# EAGLE design Dimmer_up_smd (EAGLE 5.04)
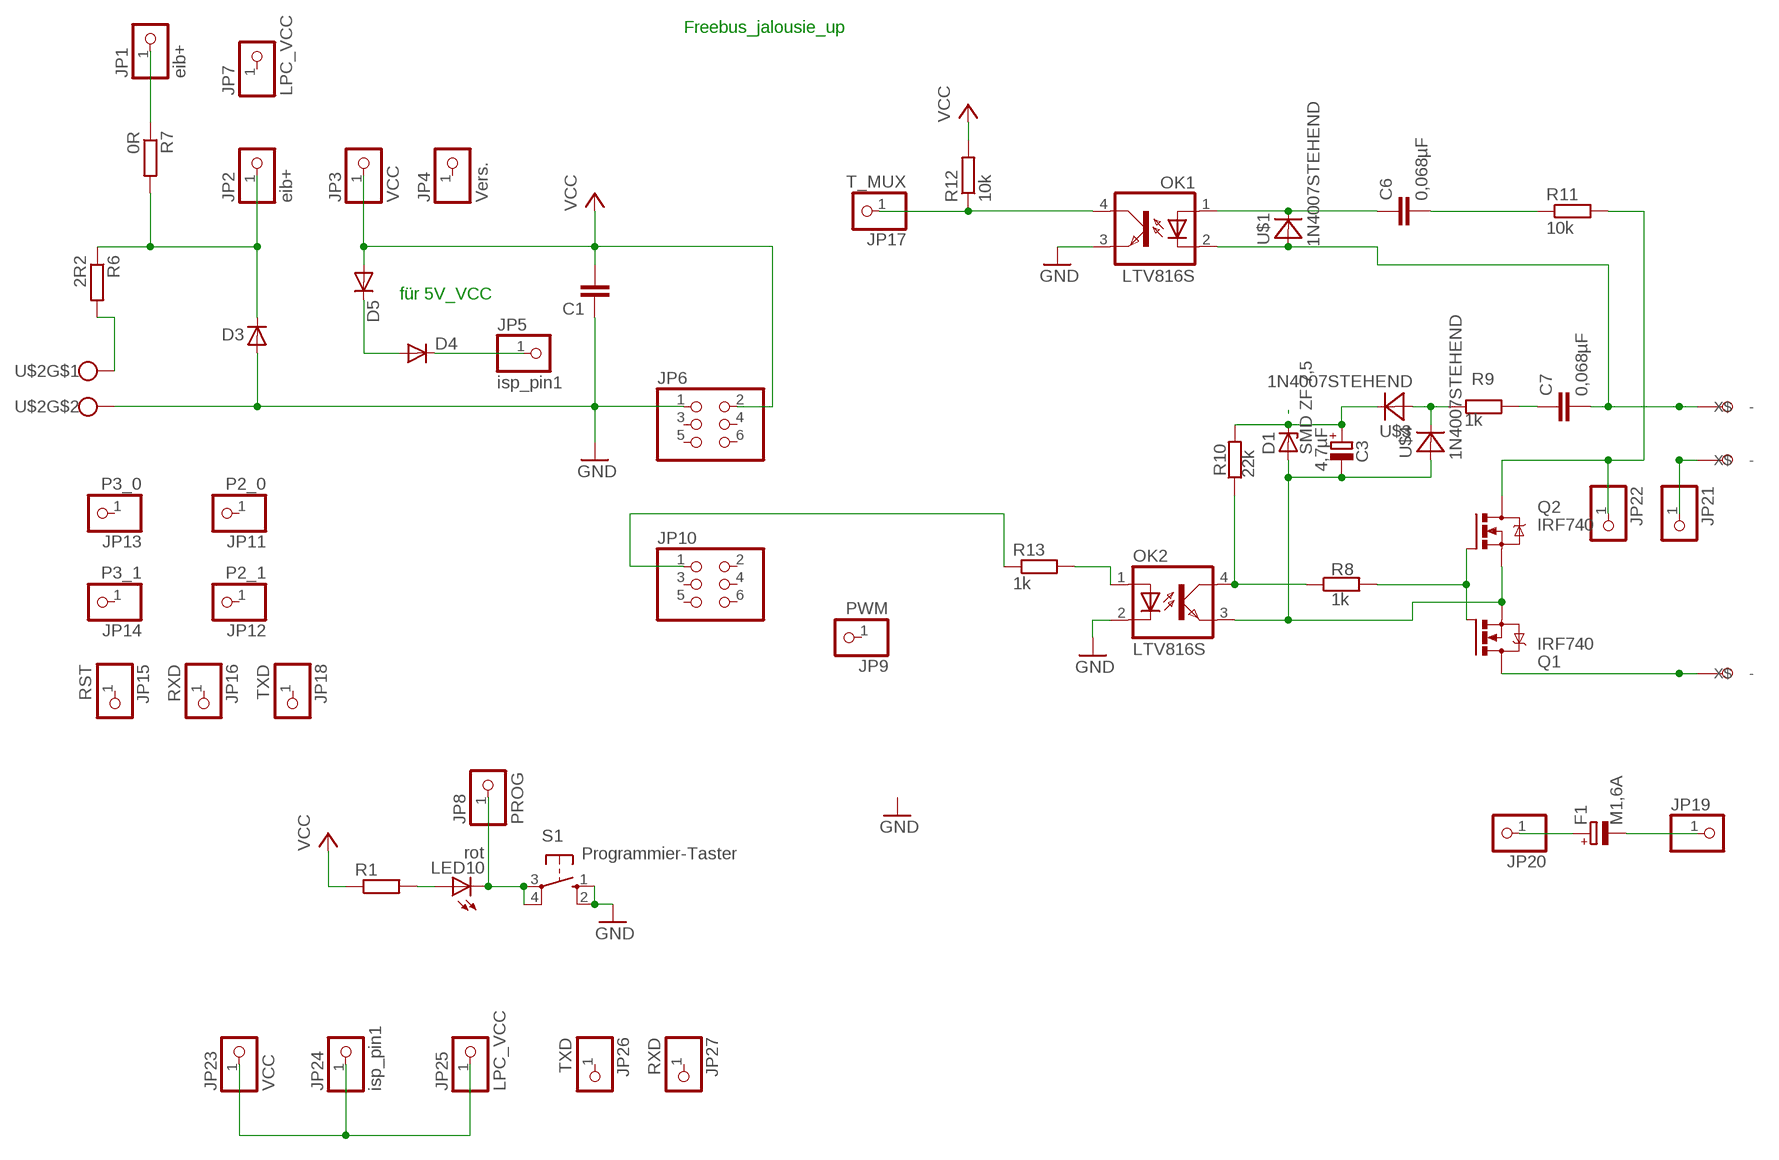
[diagram p0: schematic, sheet 1]

## Parts
C1  C-EUC1206  [C1206]
C3  4,7µF  CPOL-EUE2-4  [E2-4]
C6  0,068µF  C-EU075-063X106  [C075-063X106]
C7  0,068µF  C-EU075-063X106  [C075-063X106]
D1  SMD ZF 7,5  ZPD  [MINIMELF]
D3  D-SMB  [SMB]
D4  DIODE-MINIMELF  [MINIMELF]
D5  DIODE-MINIMELF  [MINIMELF]
DOWN  SCHRAUBKLEMME  [SCHRAUBKLEMME_PAC]
F1  M1,6A  CPOL-EUE5-8.5  [E5-8,5]
JP1  eib+  PINHD-1X1  [1X01]
JP2  eib+  PINHD-1X1  [1X01]
JP3  VCC  PINHD-1X1  [1X01]
JP4  Vers.  PINHD-1X1  [1X01]
JP5  isp_pin1  PINHD-1X1  [1X01]
JP6  PINHD-2X3  [2X03]
JP7  LPC_VCC  PINHD-1X1  [1X01]
JP8  PROG  PINHD-1X1  [1X01]
JP9  PWM  PINHD-1X1  [1X01]
JP10  PINHD-2X3  [2X03]
JP11  P2_0  PINHD-1X1  [1X01]
JP12  P2_1  PINHD-1X1  [1X01]
JP13  P3_0  PINHD-1X1  [1X01]
JP14  P3_1  PINHD-1X1  [1X01]
JP15  RST  PINHD-1X1  [1X01]
JP16  RXD  PINHD-1X1  [1X01]
JP17  T_MUX  PINHD-1X1  [1X01]
JP18  TXD  PINHD-1X1  [1X01]
JP19  PINHD-1X1  [1X01]
JP20  PINHD-1X1  [1X01]
JP21  PINHD-1X1  [1X01]
JP22  PINHD-1X1  [1X01]
JP23  VCC  PINHD-1X1  [1X01]
JP24  isp_pin1  PINHD-1X1  [1X01]
JP25  LPC_VCC  PINHD-1X1  [1X01]
JP26  TXD  PINHD-1X1  [1X01]
JP27  RXD  PINHD-1X1  [1X01]
L1  SCHRAUBKLEMME  [SCHRAUBKLEMME_PAC]
LED10  rot  LED3MM  [LED3MM]
OK1  LTV816S  [SMD4]
OK2  LTV816S  [SMD4]
Q1  IRF740  [TO220BV]
Q2  IRF740  [TO220BV]
R1  R-EU_R1206  [R1206]
R6  2R2  R-EU_R1206  [R1206]
R7  0R  R-EU_R1206  [R1206]
R8  1k  R-EU_0204/7  [0204/7]
R9  1k  R-EU_0207/2V  [0207/2V]
R10  22k  R-EU_R1206  [R1206]
R11  10k  R-EU_R1206  [R1206]
R12  10k  R-EU_R1206  [R1206]
R13  1k  R-EU_R1206  [R1206]
S1  Programmier-Taster  10-XX  [B3F-10XX]
U$1  1N4007STEHEND  [RAD2,5]
U$2  AKL059-02  [AKL3.5X2]
U$3  1N4007STEHEND  [RAD2,5]
U$4  1N4007STEHEND  [RAD2,5]
UP  SCHRAUBKLEMME  [SCHRAUBKLEMME_PAC]

## Nets
GND: C1.1 D3.2(A) JP6.1 OK1.3(EMIT) OK2.2(C) S1.1(S) S1.2(S1) U$2.2
N$2: C6.1 OK1.1(A) U$1.C
N$3: JP22.1 Q2.D R11.2
N$4: DOWN.P$1(X$) DOWN.P$2(-) Q1.D
N$5: D3.1(C) JP2.1 R6.1 R7.2
N$6: JP21.1 UP.P$1(X$) UP.P$2(-)
N$7: JP10.1 R13.1
N$8: F1.+ JP20.1
N$9: F1.- JP19.1
N$10: D4.A D5.C
N$11: JP23.1 JP24.1 JP25.1
N$12: R6.2 U$2.1
N$16: JP1.1 R7.1
N$18: JP8.1 LED10.K(C) S1.3(P) S1.4(P1)
N$19: D4.C JP5.1
N$26: JP17.1 OK1.4(COL) R12.1
N$29: OK2.1(A) R13.2
N$31: C6.2 R11.1
N$32: D1.A OK2.3(EMIT) Q1.S Q2.S
N$33: OK2.4(COL) R8.1 R10.1
N$34: C7.1 R9.2
N$35: Q1.G Q2.G R8.2
N$38: C3.+ D1.C R10.2 U$3.C
N$39: R9.1 U$3.A U$4.C
N$40: C3.- U$4.A
N$41: C7.2 L1.P$1(X$) L1.P$2(-) OK1.2(C) U$1.A
N$62: LED10.A R1.2
VCC: C1.2 D5.A JP3.1 JP6.2 R1.1 R12.2
Unconnected: JP4.1 JP6.3 JP6.4 JP6.5 JP6.6 JP7.1 JP9.1 JP10.2 JP10.3 JP10.4 JP10.5 JP10.6 JP11.1 JP12.1 JP13.1 JP14.1 JP15.1 JP16.1 JP18.1 JP26.1 JP27.1

## Notes on the sheet
- Freebus_jalousie_up
- für 5V_VCC

## Library data of the parts
C1 C6 C7 = rcl:C-EU: CAPACITOR, European symbol
C3 F1 = rcl:CPOL-EU: POLARIZED CAPACITOR, European symbol
D1 = diode:ZPD: Z DIODE 500 mW
D3 = semicon-smd-ipc:D-: DIODE unfilled
D4 D5 = diode:DIODE-: DIODE
DOWN L1 UP = freebus:SCHRAUBKLEMME
JP1-JP5 JP7-JP9 JP11-JP27 = pinhead:PINHD-1X1: PIN HEADER
JP6 JP10 = pinhead:PINHD-2X3: PIN HEADER
LED10 = led:LED: LED OSRAM: - CHIPLED LG R971, LG N971, LY N971, LG Q971, LY Q971, LO R971, LY R971 LH N974, LH R974 LS Q976, LO Q976, LY Q976 LO Q996 - Hyper CHIPLED LW Q18S LB Q993, LB Q99A, LB R99A - SideLED LS A670, LO A670, LY A670, LG A670, LP A670 LB A673, LV A673, LT A673, LW A673 LH A674 LY A675 LS A676, LA A676, LO A676, LY A676, LW A676 LS A679, LY A679, LG A679 - Hyper Micro SIDELED® LS Y876, LA Y876, LO Y876, LY Y876 LT Y87S - SmartLED LW L88C, LW L88S LB L89C, LB L89S, LG L890 LS L89K, LO L89K, LY L89K LS L896, LA L896, LO L896, LY L896 - TOPLED LS T670, LO T670, LY T670, LG T670, LP T670 LSG T670, LSP T670, LSY T670, LOP T670, LYG T670 LG T671, LOG T671, LSG T671 LB T673, LV T673, LT T673, LW T673 LH T674 LS T676, LA T676, LO T676, LY T676, LB T676, LH T676, LSB T676, LW T676 LB T67C, LV T67C, LT T67C, LS T67K, LO T67K, LY T67K, LW E67C LS E67B, LA E67B, LO E67B, LY E67B, LB E67C, LV E67C, LT E67C LW T67C LS T679, LY T679, LG T679 LS T770, LO T770, LY T770, LG T770, LP T770 LB T773, LV T773, LT T773, LW T773 LH T774 LS E675, LA E675, LY E675, LS T675 LS T776, LA T776, LO T776, LY T776, LB T776 LHGB T686 LT T68C, LB T68C - Hyper Mini TOPLED® LB M676 - Mini TOPLED Santana® LG M470 LS M47K, LO M47K, LY M47K Source: http://www.osram.convergy.de - LUMILED® LXK2-PW12-R00, LXK2-PW12-S00, LXK2-PW14-U00, LXK2-PW14-V00 LXK2-PM12-R00, LXK2-PM12-S00, LXK2-PM14-U00 LXK2-PE12-Q00, LXK2-PE12-R00, LXK2-PE12-S00, LXK2-PE14-T00, LXK2-PE14-U00 LXK2-PB12-K00, LXK2-PB12-L00, LXK2-PB12-M00, LXK2-PB14-N00, LXK2-PB14-P00, LXK2-PB14-Q00 LXK2-PR12-L00, LXK2-PR12-M00, LXK2-PR14-Q00, LXK2-PR14-R00 LXK2-PD12-Q00, LXK2-PD12-R00, LXK2-PD12-S00 LXK2-PH12-R00, LXK2-PH12-S00 LXK2-PL12-P00, LXK2-PL12-Q00, LXK2-PL12-R00 Source: www.luxeon.com
OK1 OK2 = optocoupler:LTV816: OPTO COUPLER Source: LITEON, LTV816.pdf
Q1 Q2 = transistor-power:IRF740: N-CHANNEL MOS FET
R1 R6-R13 = rcl:R-EU_: RESISTOR, European symbol
S1 = switch-omron:10-XX: OMRON SWITCH
U$1 U$3 U$4 = diode:1N4007
U$2 = con-wago-500:AKL059-02

## Board
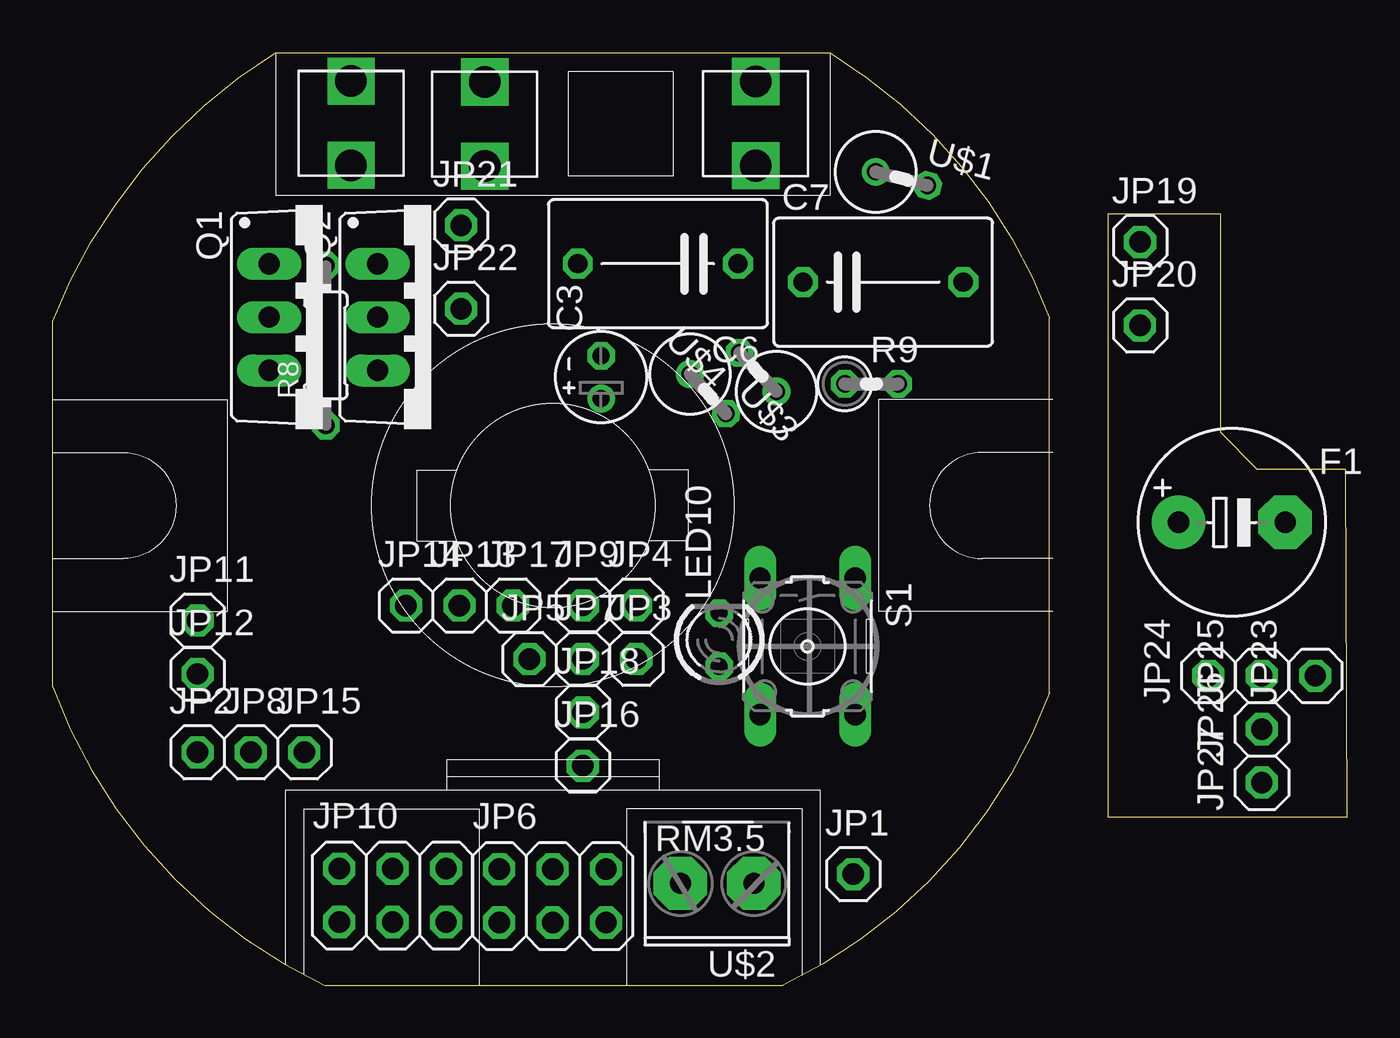
[diagram p1: board, top side]
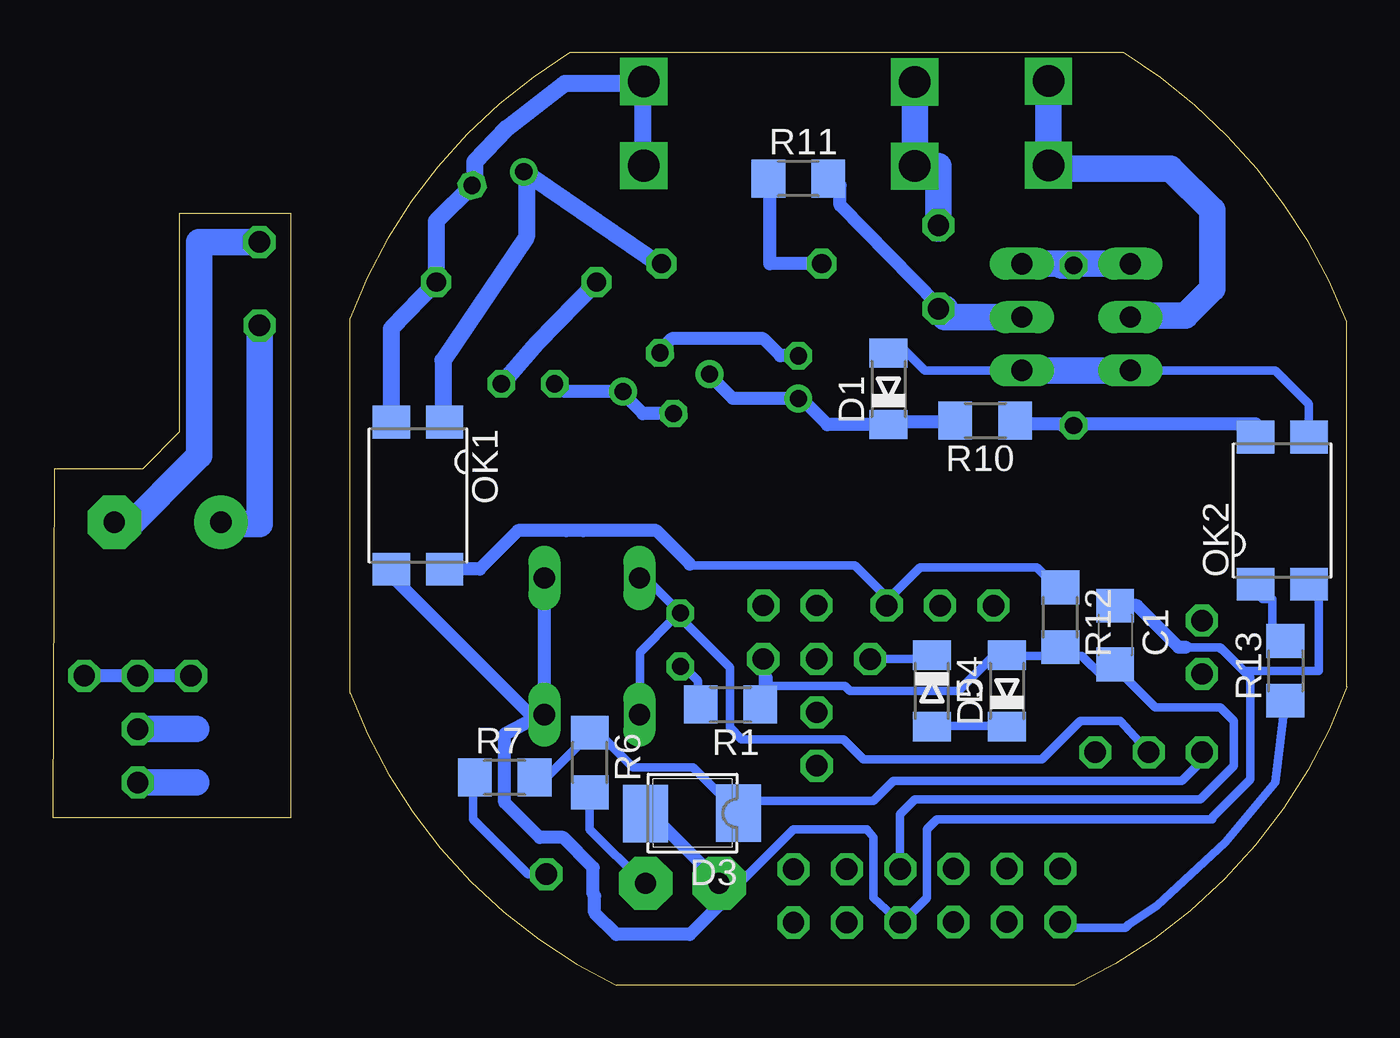
[diagram p2: board, bottom side, seen from below]

Size 61.58 x 44.38 mm. Coordinates in mm from the lower left corner, seen from the top.
Outline: 10.61,44.38 36.96,44.38
Outline: 47.42,13.9 47.43,31.75
Outline: 12.95,0 34.75,0
Outline: 12.95,0 arc-44 0,14.19 0,31.58 arc-36 10.61,44.38
Outline: 36.97,44.38 arc-38 47.43,31.76
Outline: 47.42,13.91 arc-44 34.75,0
Outline: 50.23,36.72 55.55,36.72 55.55,26.32 57.3,24.57 61.5,24.57 61.58,7.98 50.23,7.98 50.23,36.72
Copper layers (1*16): Top 0.035mm / dielectric 1.5mm / Bottom 0.035mm
Design rules "default *": minimum track width 10mil, minimum drill 24mil, track to track 8mil, track to pad 8mil, pad to pad 8mil, via to via 8mil, smd to smd 8mil, copper to edge 20mil, drill to drill 8mil, minimum pad ring 10mil, minimum via ring 8mil, stop-mask expansion 4mil, vias tented up to drill 0mil, thermal gap 10mil

### Footprints (pad centres in the part's own frame; a part is rotated, then mirrored left to right if it is on the bottom)
C1206 = smd 1.6 x 1.8: 1 -1.4,0; 2 1.4,0
E2-4 = drill 0.813 pad 1.27 round: + -1.016,0 | drill 0.813 pad 1.27 octagon: - 1.016,0
C075-063X106 = drill 0.914 octagon: 1 -3.81,0; 2 3.81,0
MINIMELF = smd 1.4 x 1.8: A 1.7,0; C -1.7,0
SMB = smd 2.159 x 2.743: 1 -2.311,-0.127; 2 2.108,-0.102
SCHRAUBKLEMME_PAC = drill 1.5 pad 1.93 square: P$1 -2,0; P$2 2,0
E5-8,5 = drill 1.016 pad 2.54 round: + -2.54,0 | drill 1.016 pad 2.54 octagon: - 2.54,0
1X01 = drill 1.016 octagon: 1 0,0
2X03 = drill 1.016 octagon: 1 -2.54,-1.27; 2 -2.54,1.27; 3 0,-1.27; 4 0,1.27; 5 2.54,-1.27; 6 2.54,1.27
LED3MM = drill 0.813 octagon: A -1.27,0; K 1.27,0
SMD4 = smd 1.78 x 1.55: 1 -1.27,-3.5; 2 1.27,-3.5; 3 1.27,3.5; 4 -1.27,3.5
TO220BV = drill 1.016 long: D 0,-2.54; G -2.54,-2.54; S 2.54,-2.54
R1206 = smd 1.6 x 1.803: 1 -1.422,0; 2 1.422,0
0204/7 = drill 0.813 octagon: 1 -3.81,0; 2 3.81,0
0207/2V = drill 0.813 octagon: 1 -1.27,0; 2 1.27,0
B3F-10XX = drill 1.016 long: 1 -3.251,2.261; 2 3.251,2.261; 3 -3.251,-2.261; 4 3.251,-2.261
RAD2,5 = drill 0.813 octagon: A 1.27,0 | drill 0.813 round: C -1.27,0
AKL3.5X2 = drill 1 pad 2.54 octagon: 1 -1.75,-0.1; 2 1.75,-0.1

### Placement (x,y rotation side)
C1  11.03,16.67 270 bottom
C3  26.1,28.94 90 top
C6  28.8,34.34 180 top
C7  39.52,33.46 0 top
D1  21.82,28.38 90 bottom
D3  31.26,8.06 180 bottom
D4  19.75,14.02 270 bottom
D5  16.18,14.02 90 bottom
DOWN  14.2,41.02 270 top
F1  56.11,22.03 0 top
JP1  38.09,5.29 0 top
JP2  6.89,11.09 0 top
JP3  27.77,15.53 0 top
JP4  27.77,18.07 0 top
JP5  22.69,15.52 0 top
JP6  23.79,4.26 0 top
JP7  25.23,15.53 0 top
JP8  9.43,11.09 0 top
JP9  25.23,18.08 0 top
JP10  16.18,4.28 0 top
JP11  6.9,17.36 0 top
JP12  6.9,14.82 0 top
JP13  19.36,18.07 0 top
JP14  16.82,18.07 0 top
JP15  11.97,11.09 0 top
JP16  25.23,10.45 0 top
JP17  21.9,18.07 0 top
JP18  25.23,12.99 0 top
JP19  51.74,35.37 0 top
JP20  51.74,31.4 0 top
JP21  19.43,36.16 0 top
JP22  19.43,32.19 0 top
JP23  60.07,14.73 90 top
JP24  54.99,14.73 90 top
JP25  57.53,14.73 90 top
JP26  57.53,12.19 90 top
JP27  57.53,9.65 90 top
L1  33.45,41 270 top
LED10  31.72,16.44 90 top
OK1  44.2,23.3 180 bottom
OK2  3.08,22.59 0 bottom
Q1  12.85,31.8 270 top
Q2  18.01,31.8 270 top
R1  29.33,13.37 180 bottom
R6  36.02,10.6 270 bottom
R7  40.07,9.89 0 bottom
R8  13.01,30.45 90 top
R9  38.96,28.62 0 top
R10  17.21,26.88 180 bottom
R11  26.1,38.38 0 bottom
R12  13.64,17.51 270 bottom
R13  2.92,14.97 90 bottom
S1  35.92,16.13 270 top
U$1  40.39,38.38 345.3 top
U$2  31.62,4.75 180 top
U$3  31.18,28.15 312.2 top
U$4  33.56,29.18 133.6 top
UP  20.56,40.98 90 top

### Tracks (layer width: path | path; a pad name or v marks a point on that pad's centre or on a via)
GND
  Bottom 0.406: 6.42,7.9 8.08,7.9 19.51,7.9 19.99,7.43 19.99,4.17 21.01,3.15 JP6.1 21.25,2.97 22.53,4.17 22.53,7.03 22.85,7.43 22.93,7.43 | 7.69,16.08 6.02,16.08 5.98,16.04 | 4.83,14.89 4.59,14.65 4.59,9.81 6.42,7.98 6.42,7.9 | 4.83,14.89 5.98,16.04 | 6.42,7.9 | 5.98,16.04 6.02,16 | 5.98,16.04 | 4.83,14.89 4.75,14.97 1.34,14.97 1.34,18.69 1.5,18.69 OK2.2 | 38.68,12.71 38.52,12.71 38.33,12.91 | 29.83,3.86 29.83,3.94 26.34,7.43 22.93,7.43 | 22.93,7.43
  Bottom 0.61: 7.69,16.08 8,16.08 9.99,18.06 10.94,18.06 10.95,18.07 C1.1 | OK1.3 45.47,19.49 38.68,12.71 40.07,11.95 40.07,8.7 38.4,7.03 37.29,7.03 35.86,5.6 35.86,4.33 35.79,4.25 35.79,3.46 34.75,2.43 31.26,2.43 29.83,3.86 | S1.2 38.3,12.88 38.33,12.91 38.18,13.05 S1.1 | 29.83,4.89 | 29.83,4.89 U$2.2 | 29.83,3.86 29.83,4.89 | D3.2 33.11,8.17 29.83,4.89 | 29.83,3.86 29.83,4.89
N$2
  Bottom 0.61: 43.01,26.8 OK1.1
  Bottom 0.813: OK1.1 43.01,27.11 43.01,29.73 39.04,35.61 39.04,38.74 U$1.C 32.53,34.18 C6.1
N$3
  Bottom 0.61: R11.2 24.51,38.38 24.12,38.07 24.12,37.11 19.43,32.35 | 19.43,32.35 | JP22.1 19.43,32.35
  Bottom 1.27: 19.12,32.19 | 19.12,32.19 JP22.1 | Q2.D 19.12,31.8 19.12,32.19
N$4
  Bottom 1.27: Q1.D 10.39,31.88 7.69,31.88 6.42,33.15 6.42,36.88 8.4,38.86 14.04,38.86 DOWN.P$2 14.2,42.84 14.27,42.91 14.2,42.98 DOWN.P$1
N$5
  Bottom 0.406: JP2.1 6.89,10.68 7.85,9.73 21.58,9.73 22.53,8.78 28.88,8.78 28.88,8.19 D3.1 28.95,8.21 31.1,10.37 33.96,10.37 35.62,12.03 R6.1 36.02,11.95 38.09,9.89 R7.2
N$6
  Bottom 1.27: 19.43,36 JP21.1 19.43,38.98 UP.P$1 20.56,42.81 20.55,42.83 20.56,42.84 UP.P$2
N$7
  Bottom 0.406: R13.1 3.4,9.65 5.78,6.79 9.04,3.78 10.39,2.9 10.54,2.75 13.56,2.75 13.56,2.93 JP10.1
N$8
  Bottom 1.27: JP20.1 | JP20.1 51.74,21.95 53.33,21.95 53.33,22.03 F1.+
N$9
  Bottom 1.27: JP19.1 54.6,35.37 54.6,25.21 58.25,21.56 58.65,21.95 F1.-
N$10
  Bottom 0.406: D4.A 19.72,12.35 16.21,12.35 D5.C
N$11
  Bottom 0.61: JP25.1 JP23.1 60.15,14.65 | JP24.1 JP25.1 | JP25.1
N$12
  Bottom 0.406: U$2.1 33.45,4.85 36.02,7.43 R6.2
N$14
  Bottom 1.27: 54.76,12.19 57.53,12.19
N$15
  Bottom 1.27: 54.76,9.65 57.53,9.65
N$16
  Bottom 0.406: JP1.1 38.97,5.29 41.58,7.9 41.58,9.73 41.49,9.82 R7.1
N$18
  Bottom 0.406: 31.56,17.33 29.36,15.13 29.36,12.27 28.8,11.71 23.96,11.71 23.01,10.76 14.51,10.76 12.69,12.59 10.78,12.59 JP8.1 | JP8.1 | JP8.1 | LED10.K 31.66,17.67 | LED10.K 31.72,17.69 31.82,17.59 | S1.3 33.37,19.38 LED10.K | 31.82,17.59 31.95,17.45 32.03,17.45 33.64,15.84 33.64,13.14 33.72,13.06 33.71,13.05 33.71,12.97 33.64,12.91 S1.4 | 31.56,17.33 | 31.56,17.33 31.82,17.59
N$19
  Bottom 0.406: D4.C 19.94,15.52 JP5.1
N$26
  Bottom 0.406: R12.1 13.79,18.93 14.75,19.89 20.31,19.89 21.97,18.22 21.9,18.15 JP17.1 21.9,18.46 23.4,19.97 31.18,19.97 31.26,20.05 | 42.69,19.81 42.7,19.8 OK1.4
  Bottom 0.61: OK1.4 42.92,19.8 41.26,19.81 39.44,21.64 37.13,21.64 36.34,21.64 32.85,21.64 31.26,20.05
N$29
  Bottom 0.406: 2.45,16.79 R13.2 3,16.32 3.32,16.32 3.56,16.56 3.56,18.37 4.04,18.37 OK2.1
N$31
  Bottom 0.61: R11.1 27.45,38.38 27.45,34.34 C6.2
N$32
  Bottom 0.406: 11.18,29.26 Q1.S 3.4,29.26 1.81,27.67 1.81,26.16 | 15.94,29.26 16.02,29.18 16.1,29.26 Q2.S 20.07,29.26 21.02,30.21 21.21,30.16 D1.A | 1.81,26.16 | 1.81,26.16 1.5,26.16 OK2.3
  Bottom 1.27: Q1.S 15.94,29.26
N$33
  Bottom 0.406: 4.35,26.17 4.04,26.17 OK2.4
  Bottom 0.61: R10.1 15.63,26.72 13.56,26.72 13.56,26.64 R8.1 13.48,26.72 4.35,26.72 4.35,26.17
N$34
  Bottom 0.61: C7.1 35.55,33.54
  Bottom 0.813: R9.2 38.56,30.53 C7.1
N$35
  Bottom 1.27: Q1.G 13.56,34.34 13.56,34.26 R8.2 13.64,34.34 Q2.G
N$38
  Bottom 0.406: 20.62,26.8 20.58,26.84 D1.C
  Bottom 0.61: R10.2 18.64,26.8 21.37,26.8 D1.C 24.72,26.68 25.96,27.92 C3.+ 29.21,27.92 30.33,29.04 U$3.C
N$39
  Bottom 0.61: U$3.A 33.5,27.2 34.44,28.15 U$4.C 37.25,28.26 37.61,28.62 R9.1
N$40
  Bottom 0.61: C3.- 26.96,29.96 27.77,30.76 32.13,30.76 32.77,30.13 32.74,30.1 U$4.A
N$41
  Bottom 0.61: 45.63,26.72 45.54,26.8 OK1.2
  Bottom 0.813: L1.P$2 33.48,39 33.48,42.91 37.21,42.91 39.99,40.77 41.5,39.18 41.5,38.23 U$1.A 43.33,36.35 43.33,33.38 | 43.33,33.38 | 43.33,33.38 C7.2 45.47,31.24 OK1.2 | OK1.2
  Bottom 1.27: 33.48,42.75 33.45,42.79 L1.P$1 | 33.48,42.91 33.48,42.75 | 33.48,42.75 33.56,42.67
N$62
  Bottom 0.406: LED10.A 31.54,15.17 30.86,14.49 30.86,13.54 30.71,13.38 30.72,13.37 R1.2
VCC
  Bottom 0.406: JP6.2 21.18,5.53 21.26,5.6 21.26,8.14 20.55,8.86 6.97,8.86 5.38,10.44 5.38,12.59 6.02,13.22 9.12,13.22 11.1,15.21 C1.2 | 27.87,13.2 27.93,13.14 | 27.87,13.2 27.72,13.24 | 27.77,14.81 27.77,13.3 27.87,13.2 | 27.77,14.81 JP3.1 | 27.77,14.81 27.61,14.81 27.52,14.64 | C1.2 11,15.27 | C1.2 11.03,15.2 11.58,14.65 12.61,15.68 | 27.52,14.64 27.53,14.25 23.88,14.25 23.64,14.02 18.48,14.02 16.81,15.68 16.21,15.68 D5.A 16.15,15.68 12.61,15.68 | 27.52,14.64 | R12.2 13.24,15.68 12.61,15.68
  Bottom 1.27: R1.1 27.93,13.38 | R1.1 | 27.77,13.3 27.84,13.3 R1.1

### Text on the board
tDocu: La' | L1 | N